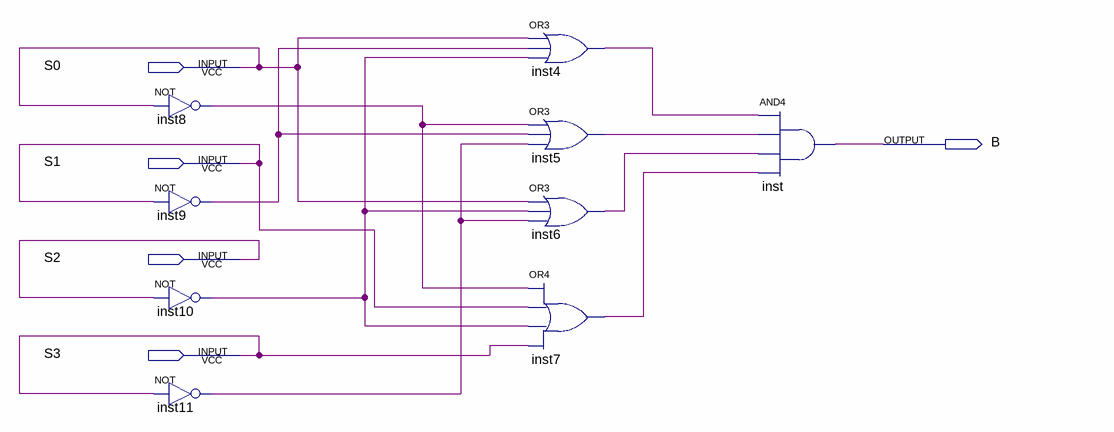
[diagram p0: schematic sheet]
// Quartus schematic B-nda2_3.bdf as structural Verilog: 9 symbols, 5 pins
module \B-nda2_3  (
  input  S0,
  input  S1,
  input  S2,
  input  S3,
  output B
);

  wire inst4_out, inst5_out, inst6_out, inst7_out, inst8_out, inst9_out, inst10_out, inst11_out;

  not inst8 (inst8_out, S0);
  not inst9 (inst9_out, S1);
  not inst10 (inst10_out, S2);
  not inst11 (inst11_out, S3);
  or inst4 (inst4_out, S0, inst9_out, inst10_out);
  or inst5 (inst5_out, inst8_out, inst9_out, inst11_out);
  or inst6 (inst6_out, S0, inst10_out, inst11_out);
  or inst7 (inst7_out, inst8_out, S1, inst10_out, S3);
  and inst (B, inst4_out, inst5_out, inst6_out, inst7_out);
endmodule
